# Altium schematic sheet RFID_P5 Board Schematic.SchDoc: Title
size A3; SheetTitle: Project Schematic; ApprovalDate: dd/mm/yyyy; DesignedBy: Boris Sharff; PartName: RFID_P5 CU board; PageSetup: Record=PageOptions|CenterHorizontal=True|CenterVertical=True|PrintScale=1.00|XCorrection=1.00|YCorrection=1.00|PrintKind=1|BorderSize=5000000|LeftOffset=0|BottomOffset=0|Orientation=2|PaperLength=1000|PaperWidth=1000|Scale=100|PaperSource=7|PrintQuality=-3|MediaType=1|DitherType=10|PrintScaleMode=0|PaperKind=A4|PaperIndex=9; Title2: RFDID_P5 CU Board Project Schematic; Date: *******; ApprovedBy: *******; CheckedBy: None; Author: *******; CompanyName: *******; DrawnBy: Name; Engineer: *******; Organization: *******; Address1: *******; Address2: *******; Address3: *******; Address4: *******; DocumentNumber: Doc Num; Revision: *******; SheetNumber: 1; SheetTotal: *******; CurrentTime: *******; CurrentDate: *******; Time: *******; DocumentFullPathAndName: *******; DocumentName: *******; ModifiedDate: *******; ImagePath: *******; ProjectName: *******; Application_BuildNumber: *******
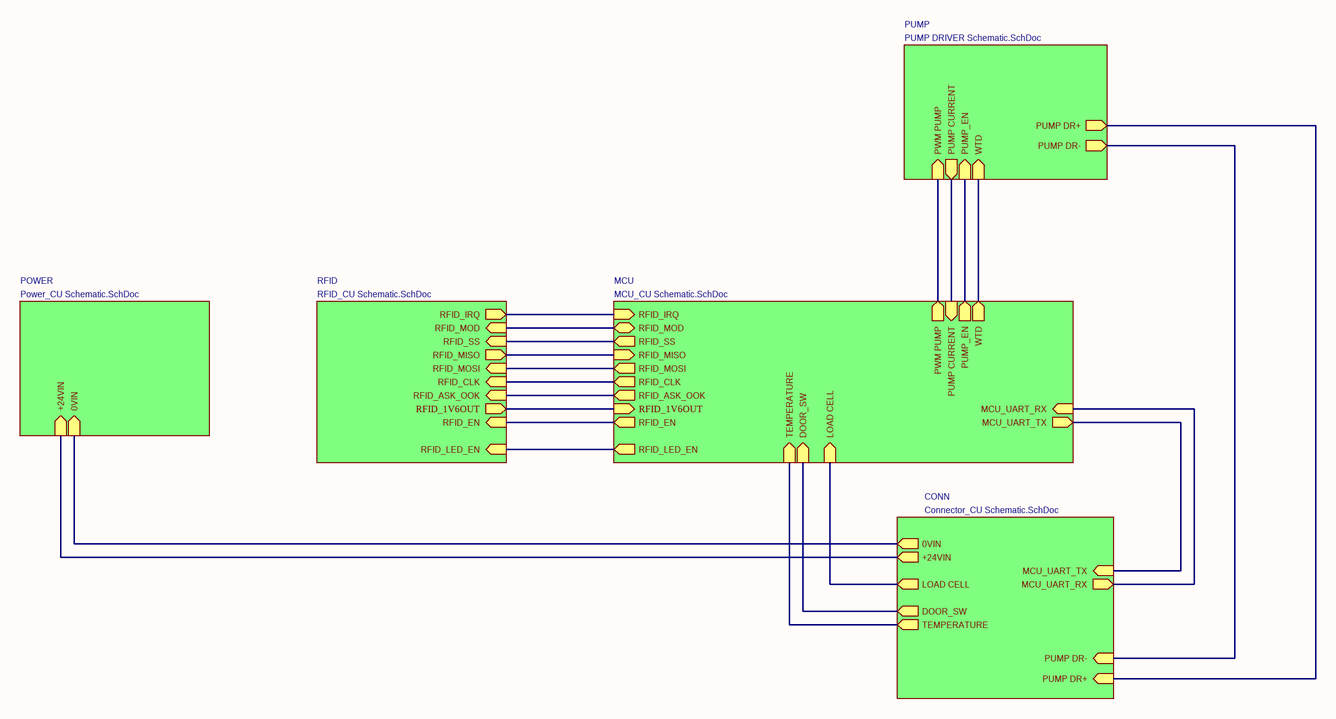
[diagram p0: RFID_P5 Board Schematic.SchDoc]

## Sub-sheets
CONN = Connector_CU Schematic.SchDoc: DOOR_SW (out), LOAD CELL (out), 0VIN (out), +24VIN (out), MCU_UART_RX (out), MCU_UART_TX (in), TEMPERATURE (out), PUMP DR+ (in), PUMP DR- (in)
MCU = MCU_CU Schematic.SchDoc: RFID_CLK (out), RFID_IRQ (in), RFID_EN (out), MCU_UART_TX (out), RFID_SS (out), RFID_MOD (bidir), MCU_UART_RX (in), DOOR_SW (in), RFID_MISO (in), RFID_MOSI (out), RFID_LED_EN (out), RFID_ASK_OOK (out), LOAD CELL (in), TEMPERATURE (in), RFID_1V6OUT (in), PWM PUMP (out), PUMP CURRENT (in), PUMP_EN (out), WTD (out)
POWER = Power_CU Schematic.SchDoc: +24VIN (in), 0VIN (in)
PUMP = PUMP DRIVER Schematic.SchDoc: PUMP DR- (out), PUMP DR+ (out), PWM PUMP (in), PUMP CURRENT (out), PUMP_EN (in), WTD (in)
RFID = RFID_CU Schematic.SchDoc: RFID_IRQ (out), RFID_SS (in), RFID_EN (in), RFID_CLK (in), RFID_MOD (in), RFID_LED_EN (in), RFID_MOSI (in), RFID_MISO (out), RFID_ASK_OOK (in), RFID_1V6OUT (out)

## Nets
(unnamed): sheet RFID/RFID_IRQ, sheet MCU/RFID_IRQ
(unnamed): sheet RFID/RFID_SS, sheet MCU/RFID_SS
(unnamed): sheet RFID/RFID_EN, sheet MCU/RFID_EN
(unnamed): sheet RFID/RFID_CLK, sheet MCU/RFID_CLK
(unnamed): sheet RFID/RFID_MOD, sheet MCU/RFID_MOD
(unnamed): sheet RFID/RFID_LED_EN, sheet MCU/RFID_LED_EN
(unnamed): sheet RFID/RFID_MOSI, sheet MCU/RFID_MOSI
(unnamed): sheet RFID/RFID_MISO, sheet MCU/RFID_MISO
(unnamed): sheet RFID/RFID_ASK_OOK, sheet MCU/RFID_ASK_OOK
(unnamed): sheet RFID/RFID_1V6OUT, sheet MCU/RFID_1V6OUT
(unnamed): sheet MCU/MCU_UART_TX, sheet CONN/MCU_UART_TX
(unnamed): sheet MCU/MCU_UART_RX, sheet CONN/MCU_UART_RX
(unnamed): sheet MCU/DOOR_SW, sheet CONN/DOOR_SW
(unnamed): sheet MCU/LOAD CELL, sheet CONN/LOAD CELL
(unnamed): sheet MCU/TEMPERATURE, sheet CONN/TEMPERATURE
(unnamed): sheet MCU/PWM PUMP, sheet PUMP/PWM PUMP
(unnamed): sheet MCU/PUMP CURRENT, sheet PUMP/PUMP CURRENT
(unnamed): sheet MCU/PUMP_EN, sheet PUMP/PUMP_EN
(unnamed): sheet MCU/WTD, sheet PUMP/WTD
(unnamed): sheet POWER/+24VIN, sheet CONN/+24VIN
(unnamed): sheet POWER/0VIN, sheet CONN/0VIN
(unnamed): sheet CONN/PUMP DR+, sheet PUMP/PUMP DR+
(unnamed): sheet CONN/PUMP DR-, sheet PUMP/PUMP DR-

## Notes on the sheet
- Title:
- Drawn By:
- Page Contents:
- Ahmed - AA
- Checked By:
- Size:
- Date:
- File:
- License:
- Email:
- A4
- Number:
- Time:
- Revision:
- Sheet
- Website:
- of